# Altium schematic sheet STM32F103C8T6_custom-board.SchDoc
size 300 x 200 mm; Date: 10/12/2025; Author: @hoangg_trn; Engineer: @hoangg_trn; Revision: 0.1; SheetNumber: 1; SheetTotal: 1; Time: 15:31
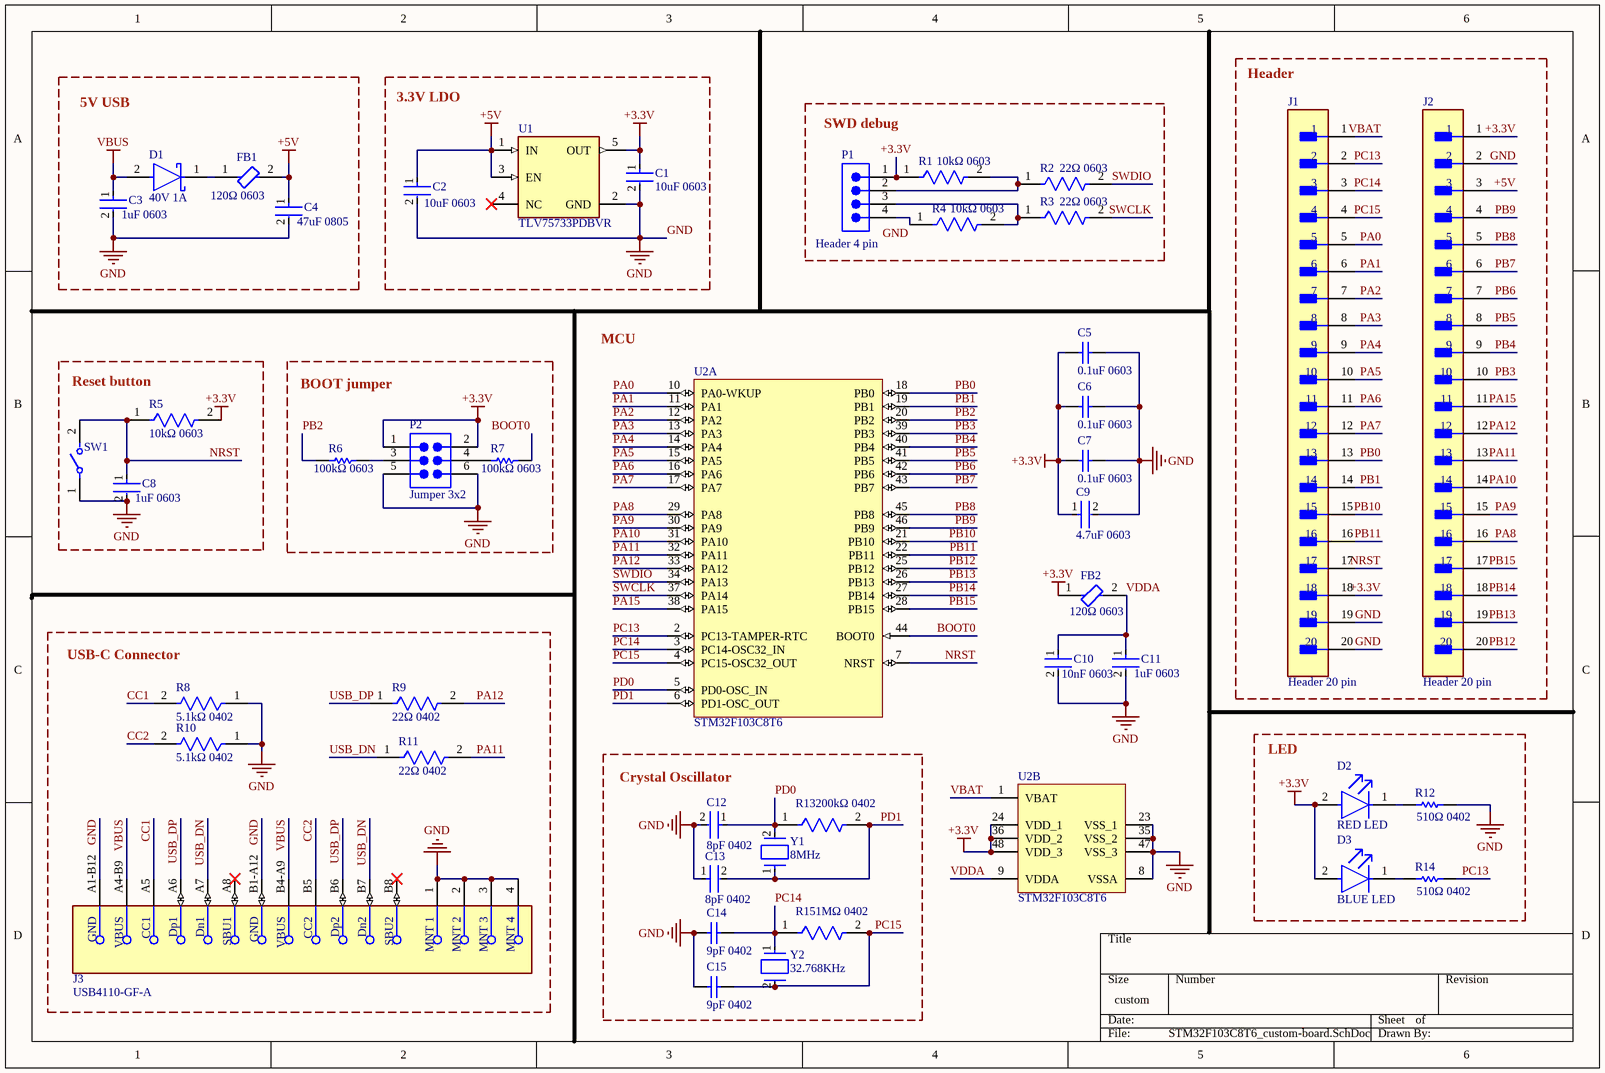
[diagram p0: STM32F103C8T6_custom-board.SchDoc]

## Parts
C1  10uF 0603  [FP-CC0603-DC-IPC_A]
C2  10uF 0603  [FP-CC0603-DC-IPC_A]
C3  1uF 0603  [FP-VJ0603Y105KXJCW1BC-MFG]
C4  47uF 0805  [FP-C2012-125-0_2-IPC_A]
C5  0.1uF 0603  [CAPC1608X95X40ML15T15]
C6  0.1uF 0603  [CAPC1608X95X40ML15T15]
C7  0.1uF 0603  [CAPC1608X95X40ML15T15]
C8  1uF 0603  [FP-VJ0603Y105KXJCW1BC-MFG]
C9  4.7uF 0603  [FP-CC0603-DC-MFG]
C10  10nF 0603  [FP-C0603C-CF-MFG]
C11  1uF 0603  [FP-VJ0603Y105KXJCW1BC-MFG]
C12  8pF 0402  [FP-C0402-BB-MFG]
C13  8pF 0402  [FP-C0402-BB-MFG]
C14  9pF 0402  [CAPC1005X56X25NL10T15]
C15  9pF 0402  [CAPC1005X56X25NL10T15]
D1  40V 1A  [FP-SOD123-IPC_A]
D2  RED LED  [FP-SML-LX0603IW-TR-MFG]
D3  BLUE LED  [FP-LTST-C191TBKT-MFG]
FB1  120Ω 0603  [FP-BLM18-0_15-t0_8-MFG]
FB2  120Ω 0603  [FP-BLM18-0_15-t0_8-MFG]
J1  Header 20 pin  [FP-TSW-120-05-G-S-MFG]
J2  Header 20 pin  [FP-TSW-120-05-G-S-MFG]
J3  USB4110-GF-A  [FP-USB4110-GF-A-MFG]
P1  Header 4 pin  [SMTC-TSW-104-08-X-S]
P2  Jumper 3x2  [SMTC-TSW-103-08-X-D]
R1  10kΩ 0603  [FP-AC0603-IPC_A]
R2  22Ω 0603  [FP-RMCF0603-IPC_A]
R3  22Ω 0603  [FP-RMCF0603-IPC_A]
R4  10kΩ 0603  [FP-AC0603-IPC_A]
R5  10kΩ 0603  [FP-AC0603-IPC_A]
R6  100kΩ 0603  [RESC0603(1608)_N]
R7  100kΩ 0603  [RESC0603(1608)_N]
R8  5.1kΩ 0402  [FP-RN73R1E-IPC_C]
R9  22Ω 0402  [FP-RMCF0402-MFG]
R10  5.1kΩ 0402  [FP-RN73R1E-IPC_C]
R11  22Ω 0402  [FP-RMCF0402-MFG]
R12  510Ω 0402  [RESC1005X40X25LL05T05]
R13  200kΩ 0402  [FP-CRCW0402-Pe3-MFG]
R14  510Ω 0402  [RESC1005X40X25LL05T05]
R15  1MΩ 0402  [FP-MCS0402-MFG]
SW1  (no value)  [FP-PTS635SK25SM-MFG]
U1  TLV75733PDBVR  [FP-DBV0005A-MFG]
U2  STM32F103C8T6  [STM-LQFP48_L]  (parts A,B of 2)
Y1  8MHz  [FP-ABM7-MFG]
Y2  32.768KHz  [FP-ABS07AIG-MFG]

## Blocks framed on the sheet
Header: J1 J2
5V USB: C3 C4 D1 FB1
3.3V LDO: C1 C2 U1
SWD debug: P1 R1-R4
Reset button: C8 R5 SW1
BOOT jumper: P2 R6 R7
USB-C Connector: J3 R8-R11
Crystal Oscillator: C12-C15 R13 R15 Y1 Y2
LED: D2 D3 R12 R14

## Nets
+3.3V: C1.1 C5.2 C6.2 C7.2 C9.1 D2.2(A) D3.2(A) FB2.1 J1.18 J2.1 P1.1 P2.1 P2.2 R1.1 R5.2 U1.5(OUT) U2.24(VDD_1) U2.36(VDD_2) U2.48(VDD_3)
+5V: C2.1 C4.1 FB1.2 J2.3 U1.1(IN) U1.3(EN)
GND: C1.2 C2.2 C3.2 C4.2 C5.1 C6.1 C7.1 C8.2 C9.2 C10.2 C11.2 C12.2 C13.1 C14.1 C15.1 J1.19 J1.20 J2.2 J3.1(MNT_1) J3.2(MNT_2) J3.3(MNT_3) J3.4(MNT_4) J3.A1-B12(GND) J3.B1-A12(GND) P1.4 P2.5 P2.6 R4.1 R8.1 R10.1 R12.2 SW1.1 U1.2(GND) U2.8(VSSA) U2.23(VSS_1) U2.35(VSS_2) U2.47(VSS_3)
VBUS: C3.1 D1.2(A) J3.A4-B9(VBUS) J3.B4-A9(VBUS)
BOOT0: R7.2 U2.44(BOOT0)
CC1: J3.A5(CC1) R8.2
CC2: J3.B5(CC2) R10.2
NRST: C8.1 J1.17 R5.1 SW1.2 U2.7(NRST)
PA0: J1.5 U2.10(PA0-WKUP)
PA1: J1.6 U2.11(PA1)
PA2: J1.7 U2.12(PA2)
PA3: J1.8 U2.13(PA3)
PA4: J1.9 U2.14(PA4)
PA5: J1.10 U2.15(PA5)
PA6: J1.11 U2.16(PA6)
PA7: J1.12 U2.17(PA7)
PA8: J2.16 U2.29(PA8)
PA9: J2.15 U2.30(PA9)
PA10: J2.14 U2.31(PA10)
PA11: J2.13 R11.2 U2.32(PA11)
PA12: J2.12 R9.2 U2.33(PA12)
PA15: J2.11 U2.38(PA15)
PB0: J1.13 U2.18(PB0)
PB1: J1.14 U2.19(PB1)
PB2: R6.1 U2.20(PB2)
PB3: J2.10 U2.39(PB3)
PB4: J2.9 U2.40(PB4)
PB5: J2.8 U2.41(PB5)
PB6: J2.7 U2.42(PB6)
PB7: J2.6 U2.43(PB7)
PB8: J2.5 U2.45(PB8)
PB9: J2.4 U2.46(PB9)
PB10: J1.15 U2.21(PB10)
PB11: J1.16 U2.22(PB11)
PB12: J2.20 U2.25(PB12)
PB13: J2.19 U2.26(PB13)
PB14: J2.18 U2.27(PB14)
PB15: J2.17 U2.28(PB15)
PC13: J1.2 R14.2 U2.2(PC13-TAMPER-RTC)
PC14: C14.2 J1.3 R15.1 U2.3(PC14-OSC32_IN) Y2.1
PC15: C15.2 J1.4 R15.2 U2.4(PC15-OSC32_OUT) Y2.2
PD0: C12.1 R13.1 U2.5(PD0-OSC_IN) Y1.2
PD1: C13.2 R13.2 U2.6(PD1-OSC_OUT) Y1.1
SWCLK: R3.2 U2.37(PA14)
SWDIO: R2.2 U2.34(PA13)
USB_DN: J3.A7(Dn1) J3.B7(Dn2) R11.1
USB_DP: J3.A6(Dp1) J3.B6(Dp2) R9.1
VBAT: J1.1 U2.1(VBAT)
VDDA: C10.1 C11.1 FB2.2 U2.9(VDDA)
NetD1_1: D1.1(C) FB1.1
NetD2_1: D2.1(C) R12.1
NetD3_1: D3.1(C) R14.1
NetP1_2: P1.2 R1.2 R2.1
NetP1_3: P1.3 R3.1 R4.2
NetP2_3: P2.3 R6.2
NetP2_4: P2.4 R7.1

Not connected (* = marked no-connect by the designer): J3 A8(SBU1)* B8(SBU2)*; U1 4(NC)*

## Notes on the sheet
- MCU

## Library data of the parts
C1 C2 = CMP-03422-001507-1: CAP CER 10UF 10V X5R 0603; Tolerance: 10%; Case/Package: 0603; Length: 0.063inch; Capacitance: 10uF; Dielectric: X5R; Mount: Surface Mount; Case Code (Metric): 1608; Depth: 0.8mm; Voltage Rating (DC): 10V; Voltage Rating: 10V; Lead Free: Lead Free; Resistor Type: Ceramic; Packaging: Tape and Reel; Max Operating Temperature: 85°C; Termination: SMD/SMT; Min Operating Temperature: -55°C; Weight: 7.1E-05oz; Thickness: 0.035inch; Case Code (Imperial): 0603; Package Quantity: 4000; Halogen Free: Halogen Free; RoHS Compliant: Yes; Width: 0.031inch
C3 C8 C11 = CMP-00030-45106517-1: VJ0603Y105KXJCW1BC Multilayer Ceramic Capacitor, 1 uF, 16 V, ± 10%, X7R, 0603 [1608 Metric]; Capacitance: 1µF; Voltage Rating: 16V; Dielectric Material: Tantalum; Radiation Hardening: No; RoHS: Compliant; Packaging: Tape and Reel; Material: Ceramic; Height: 950µm; Voltage Rating (DC): 16V; Tolerance: 10%; NexarPartId: 45106517; Min Operating Temperature: -55°C; Depth: 800µm; Case/Package: 0603; Length: 1.6mm; Max Operating Temperature: 125°C; Mount: Surface Mount; Lead Free: Lead Free; Dielectric: X7R
C4 = CMP-08246-006522-1: Multilayer Ceramic Capacitors 47μF ±20% 10V JB SMD 0805; Case/Package: 0805; RoHS Compliant: Yes; Tolerance: 20%; Capacitance: 47uF; Resistor Type: Ceramic; Dielectric Material: Ceramic; Width: 0.049inch; Series: C; Lead Free: Lead Free; Voltage Rating: 10V; Package Quantity: 2000; Height: 1.25mm; Voltage Rating (DC): 10V; Termination: SMD/SMT; Max Operating Temperature: 85°C; Case Code (Imperial): 0805; Thickness: 0.057inch; Mount: Surface Mount; Min Operating Temperature: -25°C; Packaging: Tape and Reel; Length: 0.079inch; Case Code (Metric): 2012
C5-C7 = CMP-2006-01550-1: Manufacturer: Vitramon; Part Number: VJ0603Y104KXQCW1BC
C9 = CMP-03422-001038-2: CAP CER 4.7UF 6.3V X7R 0603; Tolerance: 20%; RoHS Compliant: Yes; Packaging: Cut Tape; Mount: Surface Mount; Case Code (Imperial): 0603; Voltage Rating: 6.3V; Min Operating Temperature: -55°C; Case/Package: 0603; Case Code (Metric): 1608; Max Operating Temperature: 125°C; Capacitance: 4.7uF
C10 = CMP-03020-022676-1: C0603 10,000 pF X7R 30ppm/°C 5.00% 16 V; Manufacturer: KEMET; Manufacturer Part Number: C0603C103J4RACAUTO; Automotive Grade: Grade 1; Tolerance: 0.05; Voltage Rating: 16 V; Material: Ceramic; Lead Free: Yes; ComponentLink2Description: Datasheet; Temperature Range Low: -55°C; Capacitance: 10,000 pF; Height: 0.87mm; Device Class L2: Capacitors; Device Class L1: Passive Components; Automotive: Yes; ComponentLink2URL: https://api.kemet.com/component-edge/download/datasheet/C0603C100J5GACAUTO.pdf; Temperature Range High: +125°C; RoHS: TRUE; Device Class L3: Ceramic Capacitors; Package: C0603C-CF; Category: Cap; Temperature Coefficient: 30ppm/°C; Temperature: -55°C to +125°C; Value: 10,000 pF; Octopart: https://octopart.com/c0603c103j4racauto-kemet-91893811; Temperature Characteristic: X7R
C12 C13 = CMP-03020-024178-1: C0402 8.2 pF C0G 0.5 pF 50 V; Manufacturer Part Number: C0402C829D5GACAUTO; Manufacturer: Kemet; Temperature Coefficient: 15%; Voltage Rating: 50 V; Tolerance: 0.5 pF; Value: 8.2 pF; Material: Ceramic; Device Class L3: Ceramic Capacitors; RoHS: TRUE; Device Class L1: Passive Components; Ipc Land Pattern Name: CAPC10050X50; Temperature Characteristic: C0G; ComponentLink2URL: https://content.kemet.com/datasheets/KEM_C1002_X7R_SMD.pdf; Automotive: No; Package: C0402-BB; Temperature Range Low: -55°C; Octopart: https://octopart.com/c0402c829d5gacauto-kemet-89441553; Device Class L2: Capacitors; ComponentLink2Description: Datasheet; Lead Free: Yes; Capacitance: 8.2 pF; Temperature: -55°C to +125°C; Temperature Range High: +125°C; Category: Cap; Height: 0.55mm
C14 C15 = CMP-2008-02458-1: Manufacturer: AVX Interconnect / Elco; Part Number: 04023A100DAT2A
D1 = CMP-0303-00003-3: DIODE SCHOTTKY 40V 1A SOD123; Forward Voltage: 450mV; Capacitance: 110pF; Max Forward Surge Current (Ifsm): 25A; Peak Reverse Current: 50uA; Polarity: Standard; Element Configuration: Single; Max Power Dissipation: 450mW; Min Operating Temperature: -65°C; Package Quantity: 3000; Contact Plating: Tin; Weight: 0.000353oz; Max Repetitive Reverse Voltage (Vrrm): 40V; Max Reverse Voltage (DC): 40V; Height: 1.25mm; Average Rectified Current: 1A; Width: 1.7mm; Case/Package: SOD-123-2; Lead Free: Lead Free; Max Operating Temperature: 125°C; Current Rating: 1A; Termination: SMD/SMT; Forward Current: 1A; Radiation Hardening: No; Number of Pins: 2; Length: 2.85mm; Voltage Rating (DC): 40V; REACH SVHC: No SVHC; Peak Non-Repetitive Surge Current: 25A; Packaging: Tape and Reel; Output Current: 1A
D2 = CMP-57192-000012-1: LED RED DIFFUSED SMD; Luminous Intensity: 14mcd; Test Current: 20mA; Viewing Angle: 160°; Approvals: UL; Forward Voltage: 2V; Power Dissipation: 50mW; Dominant Wavelength: 635nm; Number of LEDs: 1; Lens Color: White; Height: 0.6mm; RoHS Compliant: Yes; Lead Free: Lead Free; Number of Pins: 2; Packaging: Tape and Reel; Case/Package: 0603; Length: 1.6mm; Color: Red; Max Operating Temperature: 85°C; Illumination Color: Red; Case Code (Metric): 1608; Diameter: 0.061inch; Min Operating Temperature: -25°C; Lens Style: Diffused; Mount: Surface Mount; Width: 0.8mm; Case Code (Imperial): 0603; Lens Transparency: Diffused; Wavelength: 635nm; Package Quantity: 1; Forward Current: 20mA
D3 = CMP-22017-000008-1: LED BLUE CLEAR CHIP SMD; Lens Color: Colorless; Dominant Wavelength: 475nm; Forward Current: 20mA; Wavelength: 468nm; Viewing Angle: 130°; Power Dissipation: 76mW; Luminous Intensity: 180mcd; Reverse Voltage: 5V; Number of Elements: 1; Lens Style: Diffused; Forward Voltage: 3.8V; Max Power Dissipation: 75mW; Case Code (Metric): 1608; Packaging: Tape and Reel; Case/Package: 0603; Depth: 1.6mm; Mount: Surface Mount; Lead Free: Lead Free; Min Operating Temperature: -20°C; Lens Transparency: Clear; Illumination Color: Blue; Height: 0.55mm; Test Current: 20mA; Case Code (Imperial): 0603; Max Operating Temperature: 80°C; Number of Pins: 2; Length: 0.8mm; Radiation Hardening: No; Package Quantity: 1; Number of LEDs: 1; Width: 0.8mm; Color: Blue
FB1 FB2 = CMP-06046-002776-1: Chip Ferrite Bead, 0603, 120Ω @ 100MHz, 0.05Ω, 25%, 2A; RoHS Compliant: Yes
J1 J2 = CMP-00575-00271415-1: TSW-120-05-G-S Headers & Wire Housings Classic PCB Header Strips, 0.100 pitch; NexarPartId: 271415; Manufacturer Lifecycle Status: PRODUCTION; Number of Contacts: 20; Gender: Male; Pitch: 2.54mm; Connector Type: Male Pin; Lead Free: Lead Free; Housing Material: Plastic; RoHS: Compliant; Housing Color: Black; Width: 2.54mm; Height: 2.54mm; Contact Plating: Gold; Lead Pitch: 2.54mm; Color: Black; Number of Positions: 20; Lifecycle Status: Production; Contact Material: Bronze; Contact Mating Length: 2.667mm; Length: 50.8mm; REACH SVHC: No SVHC; Termination: Solder; Mount: Through Hole; Number of Rows: 1
J3 = CMP-245163-000002-1: CONN USB 2.0 TYPE-C R/A SMT; Manufacturer: GCT; Conn Orientation: Right Angle; Usb Standard: USB 2.0; Voltage Rating: 20V; Current Rating: 3/4.25/1.25/0.25A; Number Of Contacts: 16; Is Female: yes; Shielding: true; Standoff Height: 0.1mm; Octopart: https://octopart.com/usb4110-gf-a-gct-103941985; Temperature: -40°C to +85°C; RoHS: TRUE; Automotive: No; Contact Material: Gold,Nickel; Device Class L1: Connectors; Device Class L2: USB Connectors; Package: 0; Lead Free: Yes; ComponentLink2URL: https://gct.co/files/drawings/usb4110.pdf; Temperature Range High: +85°C; Temperature Range Low: -40°C; Height: 3.46mm; Manufacturer Part Number: USB4110-GF-A; ComponentLink2Description: Datasheet; Device Class L3: unset; Digikey Description: CONN USB 2.0 TYPE-C R/A SMT; Category: Conn
P1 = CMP-1024-00357-1: 0.025" SQ Post Header, Through-hole, Vertical, -55 to 125 degC, 2.54 mm Pitch, 4-Pin, Male, RoHS; Manufacturer: Samtec; PartNumber: TSW-104-08-G-S; Pitch: 2.54 mm; RoHS: True; ComponentLink3URL: http://www.samtec.com/documents/webfiles/cpdf/TSW-XXX-XX-XXX-X-XX-XXX-MKT.pdf; Mounting Technology: Through-hole; ComponentLink2URL: http://www.samtec.com/documents/webfiles/pdf/TSW_TH.PDF; ComponentLink1URL: http://www.samtec.com; ComponentLink3Description: Package Specification; PackageVersion: DM, 8/1988; ComponentLink2Description: Datasheet; PackageReference: TSW-104-08-X-S; PackageDescription: .025[0.64] SQ. Post Terminal Strip Assembly; ComponentLink1Description: Manufacturer URL; Temperature Range: -55 to 125 degC; DatasheetVersion: F-214; Orientation: Vertical
P2 = CMP-1024-00337-1: 0.025" SQ Post Header, Through-hole, Vertical, -55 to 125 degC, 2.54 mm Pitch, 6-Pin, Male, RoHS; Manufacturer: Samtec; PartNumber: TSW-103-08-F-D; Pitch: 2.54 mm; ComponentLink1URL: http://www.samtec.com; PackageReference: TSW-103-08-X-D; ComponentLink3Description: Package Specification; PackageDescription: .025[0.64] SQ. Post Terminal Strip Assembly; DatasheetVersion: F-214; ComponentLink1Description: Manufacturer URL; ComponentLink2Description: Datasheet; ComponentLink2URL: http://www.samtec.com/documents/webfiles/pdf/TSW_TH.PDF; PackageVersion: DM, 8/1988; Orientation: Vertical; Mounting Technology: Through-hole; RoHS: True; Temperature Range: -55 to 125 degC; ComponentLink3URL: http://www.samtec.com/documents/webfiles/cpdf/TSW-XXX-XX-XXX-X-XX-XXX-MKT.pdf
R1 R4 R5 = CMP-03412-040683-1: RES 10kΩ 5.00% 0.2W 0603
R2 R3 = CMP-26527-002321-1: 22Ω ±5% 0.1W 0603 Thick Film Chip Resistor AEC-Q200 compliant; Resistance: 22R; Temperature Coefficient: 200ppm/°C; Max Power Dissipation: 100mW; Packaging: Tape and Reel; Radiation Hardening: No; Tolerance: 5%; Min Operating Temperature: -55°C; Height: 0.022inch; Case/Package: 0603; Width: 0.031inch; Contact Plating: Tin; Max Operating Temperature: 155°C; Mount: Surface Mount; Resistor Type: Thick Film; Number of Terminations: 2; Series: RMCF; Features: Automotive AEC-Q200; Length: 0.061inch; RoHS Compliant: Yes
R6 R7 = CMP-1012-00736-1: 100K 0.1W 1% 0603 (1608 Metric)  SMD; Value: 100000.00 Ohm; Case-Metric: 1608; Case-EIA: 0603; Power: 0.1 W; Tolerance: 1 %; Technology: SMT
R8 R10 = CMP-04015-008529-1: 5.1kΩ ±1% 0.063W, 1/16W Chip Resistor 0402 (1005 Metric) Moisture Resistant Thin Film
R9 R11 = CMP-26527-006952-1: 22Ω ±1% 0.063W 0402 Thick Film Chip Resistor AEC-Q200 compliant; Temperature Coefficient: 100ppm/°C; Resistance: 22R; Max Power Dissipation: 63mW; RoHS Compliant: Yes; Min Operating Temperature: -55°C; Features: Automotive AEC-Q200; Max Operating Temperature: 155°C; Number of Terminations: 2; Length: 0.039inch; Height: 0.016inch; Tolerance: 1%; Packaging: Tape and Reel; Width: 0.02inch; Resistor Type: Thick Film; Contact Plating: Tin; Case/Package: 0402; Series: RMCF; Mount: Surface Mount
R12 R14 = CMP-1011-00067-2: Manufacturer: Vishay Dale; Part Number: CRCW0402510RJNTD
R13 = CMP-03613-000144-1: RES Thick Film, 200kΩ, 1%, 0.063W, 50ppm/°C, 0402; Resistance: 200kR; Max Power Dissipation: 63mW; Resistor Type: Thick Film; Package Quantity: 10000; Width: 0.02inch; Packaging: Tape and Reel; Min Operating Temperature: -55°C; Series: CRCW-P; Case/Package: 0402; Number of Terminations: 2; Max Operating Temperature: 155°C; Features: Automotive AEC-Q200; Temperature Coefficient: 50ppm/°C; Height: 0.016inch; Tolerance: 1%; RoHS Compliant: Yes; Length: 0.039inch
R15 = CMP-2002-02478-2: RES SMD 1.2K OHM 1% 1/10W 0402; Temperature Coefficient: 25ppm/°C; Power Rating: 62.5mW; Voltage Rating (DC): 50V; Tolerance: 0.1%; Resistance: 200R; Length: 1mm; Max Operating Temperature: 125°C; Depth: 0.5mm; Lead Free: Lead Free; Min Operating Temperature: -55°C; Military Standard: Not; Packaging: Tape and Reel; Case/Package: 0402; Width: 500um; Composition: Thin Film
SW1 = CMP-10040-000010-1: SWITCH TACTILE SPST-NO 0.05A 12V; Manufacturer: C&K Components; Manufacturer Part Number: PTS635SK25SM; Operating Force: 260gf; Contact Current Rating: 50mA; Contact Resistance: 100mΩ; Throw Configuration: SPST; Electromechanical Life: 20000Cycles; Category: Switch; Digikey Description: SWITCH TACTILE SPST-NO 0.05A 12V; Temperature: -10°C to +60°C; Voltage Rating Dc: 12V; Lead Free: Yes; Temperature Range High: +60°C; ComponentLink2Description: Datasheet; Device Class L3: Tactile Switches; Octopart: https://octopart.com/pts635sk25sm-c%26k+components-8206497; Automotive: No; Height: 2.5mm; Temperature Range Low: -10°C; Mount: Surface Mount; RoHS: TRUE; Device Class L2: Switches; Package: PTS635SK25SM; Device Class L1: Electromechanical; ComponentLink2URL: https://media.digikey.com/pdf/Data%20Sheets/C&K/PTS635%20with%2025%20code%20actuator.pdf
U1 = CMP-04917-000028-1: IC REG LINEAR 3.3V 1A SOT23-5; Manufacturer: Texas Instruments; Standoff Height: 0mm; Min Supply Voltage: 1.45V; Dropout Voltage: 1350mV; Output Type: Fixed; Max Junction Temp: +125°C; Max Supply Voltage: 5.5V; Number Of Outputs: 1; Accuracy Percentage: 1%; Manufacturer Part Number: TLV75733PDBVR; ComponentLink2Description: Datasheet; Temperature: -40°C to +125°C; RoHS: TRUE; ComponentLink2URL: http://www.ti.com/lit/ds/symlink/tlv757p.pdf; Output Voltage: 3.3V; Mouser Description: 1-A low-IQ small-size low-dropout (LDO) regulator 5-SOT-23 -40 to 125; Ipc Land Pattern Name: SOT95P280X145-5; Device Class L2: Power Management ICs; Package: DBV0005A; Height: 1.45mm; Category: IC; Digikey Description: IC REG LINEAR 3.3V 1A SOT23-5; Temperature Range High: +125°C; Octopart: https://octopart.com/tlv75733pdbvr-texas+instruments-91437073; Temperature Range Low: -40°C; Device Class L3: Voltage Regulators - Linear; Output Current: 1A; Device Class L1: Integrated Circuits (ICs); Automotive: No; Lead Free: Yes
U2 = CMP-0237-00215-3: ARM Cortex-M3 32-bit MCU, 64 KB Flash, 20 KB Internal RAM, 37 I/Os, 48-pin LQFP, -40 to 85 degC, Tray; Supply Voltage(Vcc) min (V): 2; Internal RAM Size (kB): 20; FLASH Size (Prog) (kB): 64; A/D Converter: 2x12-bit (10 Channel); I/Os (High Current): 37; Operating Frequency(F) (Processor speed) (MHz): 72; Core: ARM Cortex-M3; ComponentLink3Description: Package Specification; Mounting Technology: Surface Mount; PartNumber: STM32F103C8T6; PackageReference: LQFP48; Packing: Tray; ComponentLink3URL: http://www.st.com/st-web-ui/static/active/en/resource/technical/document/datasheet/DM00058181.pdf; DatasheetVersion: Rev. 16; ComponentLink1URL: http://www.st.com/web/en/home.html; PackageVersion: Rev. 6, 06/2013; ComponentLink2URL: http://www.st.com/st-web-ui/static/active/en/resource/technical/document/datasheet/CD00161566.pdf; ComponentLink1Description: Manufacturer URL; ComponentLink2Description: Datasheet; PackageDescription: 48-Pin Low Profile Quad Flat Package, 7 x 7 mm Body, 0.5 mm Pitch
Y1 = CMP-27762-013691-1: Crystal 8MHz ±20ppm 8pF SMD-2 6mm x 3.5mm; ESR (Equivalent Series Resistance): 80R; Frequency Stability: 30ppm; Case/Package: SMD/SMT; Load Capacitance: 8pF; Packaging: Tape and Reel; Frequency Tolerance: 20ppm; Frequency: 8MHz; Mount: Surface Mount; Max Operating Temperature: 85°C; Min Operating Temperature: -40°C
Y2 = CMP-27762-015869-1: Crystal 32.768kHz ±20ppm (Tol) 9pF FUND 70kΩ Automotive 2-Pin Mini-CSMD T/R; ESR (Equivalent Series Resistance): 70kR; Max Operating Temperature: 85°C; Frequency Tolerance: 20ppm; Frequency: 32.768kHz; Load Capacitance: 9pF; RoHS Compliant: Yes; Length: 0.126inch; Series: ABS07AIG; Width: 0.059inch; Mount: Surface Mount; Ratings: AEC-Q200; Min Operating Temperature: -40°C; Case/Package: SMD/SMT; Height: 0.035inch; Packaging: Cut Tape